# EAGLE design motherboard (EAGLE 9.6.2)
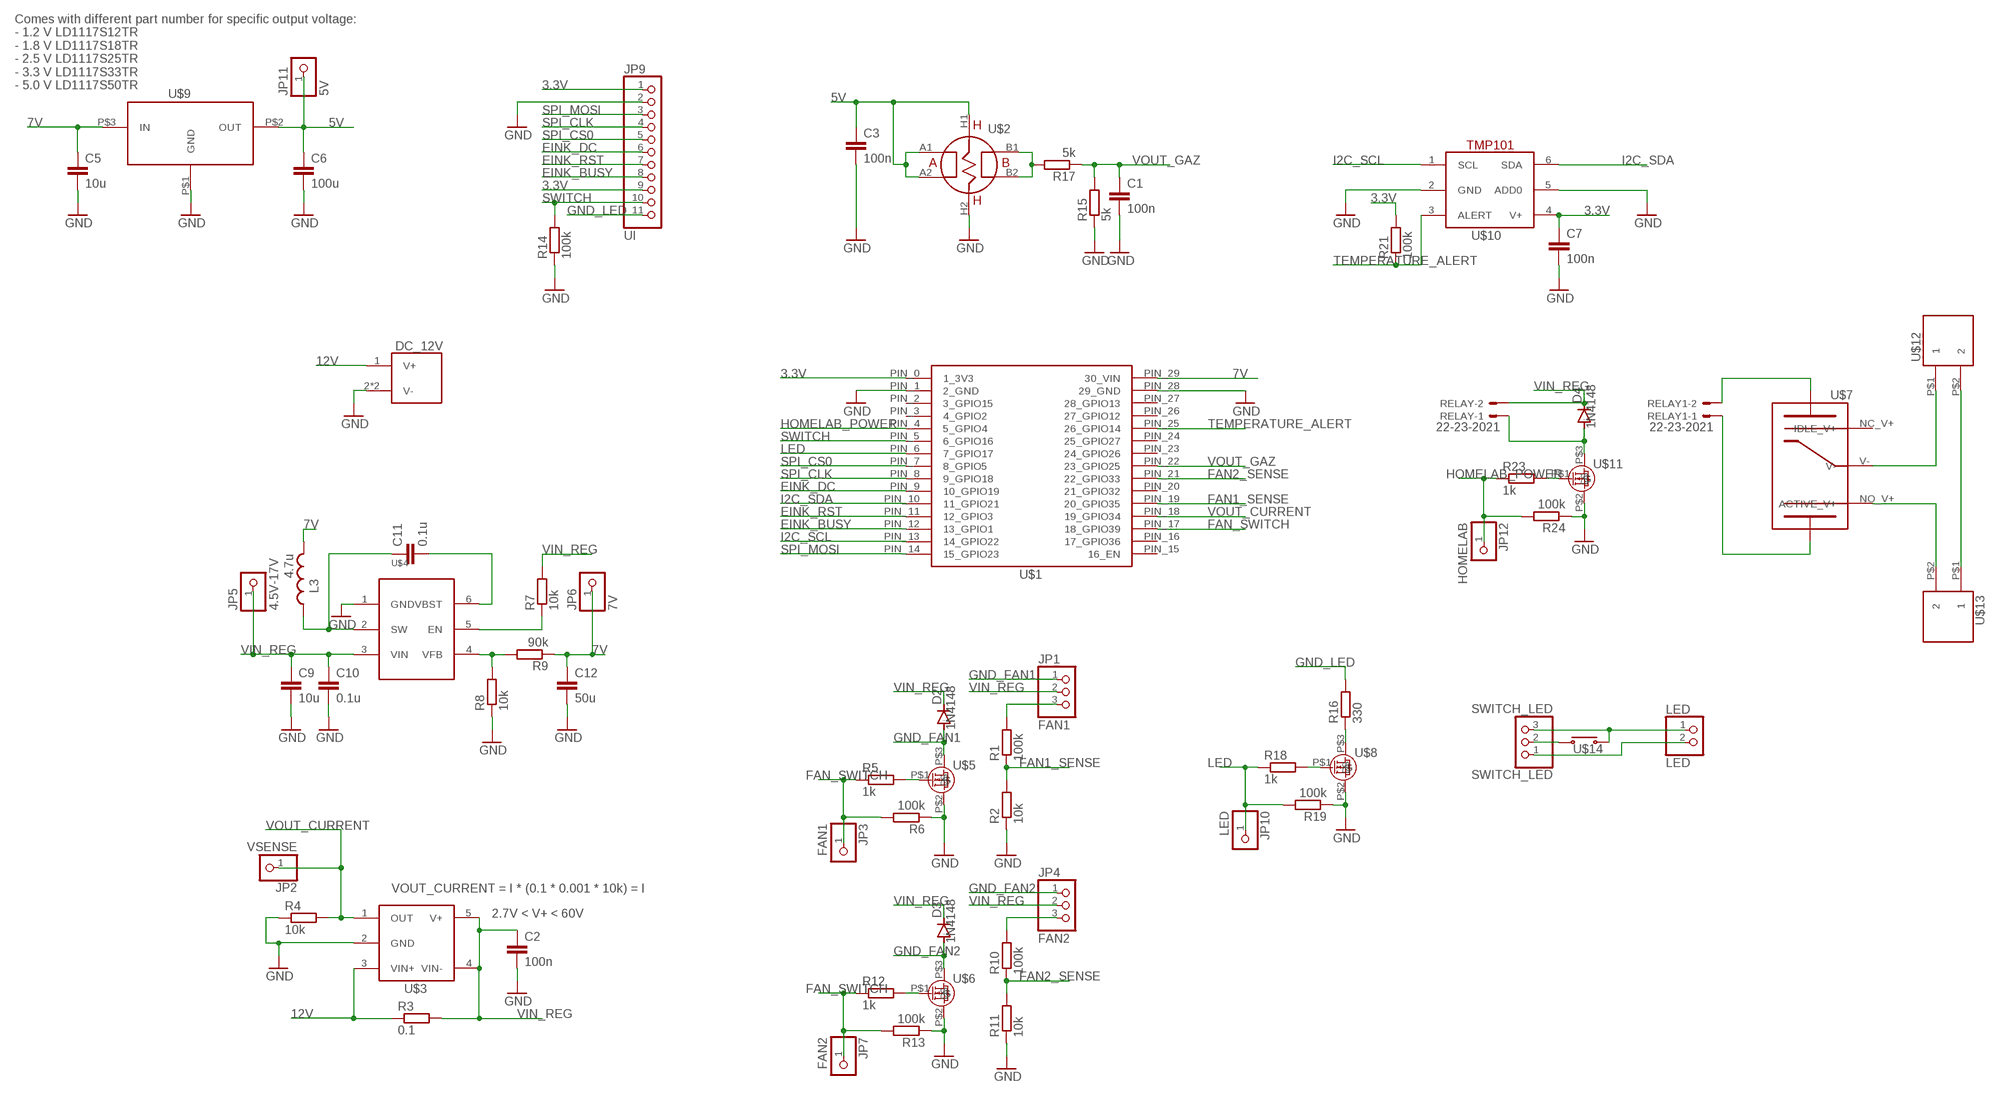
[diagram p0: schematic, sheet 1]

## Parts
C1  100n  C-EUC0805  [C0805]
C2  100n  C-EUC0805  [C0805]
C3  100n  C-EUC0805  [C0805]
C5  10u  C-EUC0805  [C0805]
C6  100u  C-EUC0805  [C0805]
C7  100n  C-EUC0805  [C0805]
C9  10u  C-EUC0805  [C0805]
C10  0.1u  C-EUC0805  [C0805]
C11  0.1u  C-EUC0805  [C0805]
C12  50u  C-EUC0805  [C0805]
D2  1N4148  DIODE-DO-214AC  [DO-214AC]
D3  1N4148  DIODE-DO-214AC  [DO-214AC]
D4  1N4148  DIODE-DO-214AC  [DO-214AC]
DC_12V  DC_POWER_2.1MM  [DC_POWER_2.1MM]
JP1  FAN1  PINHD-1X3  [1X03]
JP2  VSENSE  PINHD-1X1  [1X01]
JP3  FAN1  PINHD-1X1  [1X01]
JP4  FAN2  PINHD-1X3  [1X03]
JP5  4.5V-17V  PINHD-1X1  [1X01]
JP6  7V  PINHD-1X1  [1X01]
JP7  FAN2  PINHD-1X1  [1X01]
JP9  UI  PINHD-1X11  [1X11]
JP10  LED  PINHD-1X1  [1X01]
JP11  5V  PINHD-1X1  [1X01]
JP12  HOMELAB  PINHD-1X1  [1X01]
L3  4.7u  L-USL3225M  [L3225M]
LED  LED  PINHD-1X2  [1X02]
R1  100k  R-EU_R0805  [R0805]
R2  10k  R-EU_R0805  [R0805]
R3  0.1  R-EU_R1206  [R1206]
R4  10k  R-EU_R0805  [R0805]
R5  1k  R-EU_R0805  [R0805]
R6  100k  R-EU_R0805  [R0805]
R7  10k  R-EU_R0805  [R0805]
R8  10k  R-EU_R0805  [R0805]
R9  90k  R-EU_R0805  [R0805]
R10  100k  R-EU_R0805  [R0805]
R11  10k  R-EU_R0805  [R0805]
R12  1k  R-EU_R0805  [R0805]
R13  100k  R-EU_R0805  [R0805]
R14  100k  R-EU_R0805  [R0805]
R15  5k  R-EU_R0805  [R0805]
R16  330  R-EU_R0805  [R0805]
R17  5k  R-EU_R0805  [R0805]
R18  1k  R-EU_R0805  [R0805]
R19  100k  R-EU_R0805  [R0805]
R21  100k  R-EU_R0805  [R0805]
R23  1k  R-EU_R0805  [R0805]
R24  100k  R-EU_R0805  [R0805]
RELAY  22-23-2021  [22-23-2021]
RELAY1  22-23-2021  [22-23-2021]
SWITCH_LED  SWITCH_LED  PINHD-1X3  [1X03]
U$1  ESP32_DEVKIT_V1  [ESP32_DEVKIT_V1]
U$2  MQ_2  [MQ_2]
U$3  INA169  [SOT23_5_PIN]
U$4  TPS561201  [SOT23_6_PIN]
U$5  MGSF1N03L  [SOT23_3_PIN]
U$6  MGSF1N03L  [SOT23_3_PIN]
U$7  RELAY_SONGLE  [RELAY_SONGLE]
U$8  MGSF1N03L  [SOT23_3_PIN]
U$9  LD1117  [SOT223_3_PIN]
U$10  TMP101  [SOT23_6_PIN]
U$11  MGSF1N03L  [SOT23_3_PIN]
U$12  SCREW_TERMINAL  [SCREW_TERMINAL]
U$13  SCREW_TERMINAL  [SCREW_TERMINAL]
U$14  MOMENTARY_SWITCH  [MOMENTARY_SWITCH]

## Nets
3.3V: C7.1 JP9.1 JP9.9 R21.2 U$1.PIN_0(1_3V3) U$10.4(V+)
5V: C3.1 C6.1 JP11.1 U$2.A1 U$2.A2 U$2.H1 U$9.P$2(OUT)
7V: C5.1 C12.1 JP6.1 L3.2 R9.1 U$1.PIN_29(30_VIN) U$9.P$3(IN)
12V: DC_12V.1(V+) R3.1 U$3.3(VIN+)
EINK_BUSY: JP9.8 U$1.PIN_12(13_GPIO1)
EINK_DC: JP9.6 U$1.PIN_9(10_GPIO19)
EINK_RST: JP9.7 U$1.PIN_11(12_GPIO3)
FAN1_SENSE: R1.1 R2.2 U$1.PIN_19(20_GPIO35)
FAN2_SENSE: R10.1 R11.2 U$1.PIN_21(22_GPIO33)
FAN_SWITCH: JP3.1 JP7.1 R5.1 R6.2 R12.1 R13.2 U$1.PIN_17(18_GPIO39)
GND: C1.2 C2.2 C3.2 C5.2 C6.2 C7.2 C9.2 C10.2 C12.2 DC_12V.2(V-) DC_12V.3(V-) JP9.2 R2.1 R4.1 R6.1 R8.1 R11.1 R13.1 R14.1 R15.1 R19.1 R24.1 U$1.PIN_1(2_GND) U$1.PIN_28(29_GND) U$2.H2 U$3.2(GND) U$4.1(GND) U$5.P$2(S) U$6.P$2(S) U$8.P$2(S) U$9.P$1(GND) U$10.2(GND) U$10.5(ADD0) U$11.P$2(S)
GND_FAN1: D2.A JP1.1 U$5.P$3(D)
GND_FAN2: D3.A JP4.1 U$6.P$3(D)
GND_LED: JP9.11 R16.2
GND_RELAY: D4.A RELAY.1 U$11.P$3(D)
HOMELAB_POWER: JP12.1 R23.1 R24.2 U$1.PIN_4(5_GPIO4)
I2C_SCL: U$1.PIN_13(14_GPIO22) U$10.1(SCL)
I2C_SDA: U$1.PIN_10(11_GPIO21) U$10.6(SDA)
LED: JP10.1 R18.1 R19.2 U$1.PIN_6(7_GPIO17)
N$1: JP1.3 R1.2
N$2: R5.2 U$5.P$1(G)
N$3: JP4.3 R10.2
N$4: R12.2 U$6.P$1(G)
N$5: R17.2 U$2.B1 U$2.B2
N$6: RELAY1.2 U$7.COMMAND_V+
N$7: LED.1 SWITCH_LED.3 U$14.B1 U$14.B2
N$8: R18.2 U$8.P$1(G)
N$9: C11.2 U$4.6(VBST)
N$10: R7.1 U$4.5(EN)
N$11: R8.2 R9.2 U$4.4(VFB)
N$12: C11.1 L3.1 U$4.2(SW)
N$13: R23.2 U$11.P$1(G)
N$14: R16.1 U$8.P$3(D)
N$15: RELAY1.1 U$7.COMMAND_V-
N$16: U$12.P$2 U$13.P$1
N$17: U$7.V- U$12.P$1
N$18: U$7.NO_V+(ACTIVE_V+) U$13.P$2
N$19: LED.2 SWITCH_LED.1
N$20: SWITCH_LED.2 U$14.A1 U$14.A2
SPI_CLK: JP9.4 U$1.PIN_8(9_GPIO18)
SPI_CS0: JP9.5 U$1.PIN_7(8_GPIO5)
SPI_MOSI: JP9.3 U$1.PIN_14(15_GPIO23)
SWITCH: JP9.10 R14.2 U$1.PIN_5(6_GPIO16)
TEMPERATURE_ALERT: R21.1 U$1.PIN_25(26_GPIO14) U$10.3(ALERT)
VIN_REG: C2.1 C9.1 C10.1 D2.C D3.C D4.C JP1.2 JP4.2 JP5.1 R3.2 R7.2 RELAY.2 U$3.4(VIN-) U$3.5(V+) U$4.3(VIN)
VOUT_CURRENT: JP2.1 R4.2 U$1.PIN_18(19_GPIO34) U$3.1(OUT)
VOUT_GAZ: C1.1 R15.2 R17.1 U$1.PIN_22(23_GPIO25)
Unconnected: U$1.PIN_2(3_GPIO15) U$1.PIN_3(4_GPIO2) U$1.PIN_15(16_EN) U$1.PIN_16(17_GPIO36) U$1.PIN_20(21_GPIO32) U$1.PIN_23(24_GPIO26) U$1.PIN_24(25_GPIO27) U$1.PIN_26(27_GPIO12) U$1.PIN_27(28_GPIO13) U$7.NC_V+(IDLE_V+)

## Notes on the sheet
- Comes with different part number for specific output voltage:
  - 1.2 V LD1117S12TR
  - 1.8 V LD1117S18TR
  - 2.5 V LD1117S25TR
  - 3.3 V LD1117S33TR
  - 5.0 V LD1117S50TR
- VOUT_CURRENT = I * (0.1 * 0.001 * 10k) = I
- 2.7V < V+ < 60V

## Library data of the parts
C1-C3 C5-C7 C9-C12 = rcl:C-EU: CAPACITOR, European symbol; SPICEPREFIX: C
D2-D4 = diode:DIODE-: DIODE
DC_12V = bzd:DC_POWER_2.1MM
JP1 JP4 SWITCH_LED = pinhead:PINHD-1X3: PIN HEADER
JP2 JP3 JP5-JP7 JP10-JP12 = pinhead:PINHD-1X1: PIN HEADER
JP9 = pinhead:PINHD-1X11: PIN HEADER
L3 = rcl:L-US: INDUCTOR, American symbol; SPICEPREFIX: L
LED = pinhead:PINHD-1X2: PIN HEADER
R1-R19 R21 R23 R24 = rcl:R-EU_: RESISTOR, European symbol; SPICEPREFIX: R
RELAY RELAY1 = con-molex:22-23-2021: .100" (2.54mm) Center Header - 2 Pin; MF: MOLEX; MPN: 22-23-2021; OC_FARNELL: 1462926; OC_NEWARK: 25C3832
U$1 = bzd:ESP32_DEVKIT_V1
U$2 = bzd:MQ_2
U$3 = bzd:INA169
U$4 = bzd:TPS561201
U$5 U$6 U$8 U$11 = bzd:MGSF1N03L
U$7 = bzd:RELAY_SONGLE
U$9 = bzd:LD1117
U$10 = bzd:TMP101
U$12 U$13 = bzd:SCREW_TERMINAL
U$14 = bzd:MOMENTARY_SWITCH

## Board
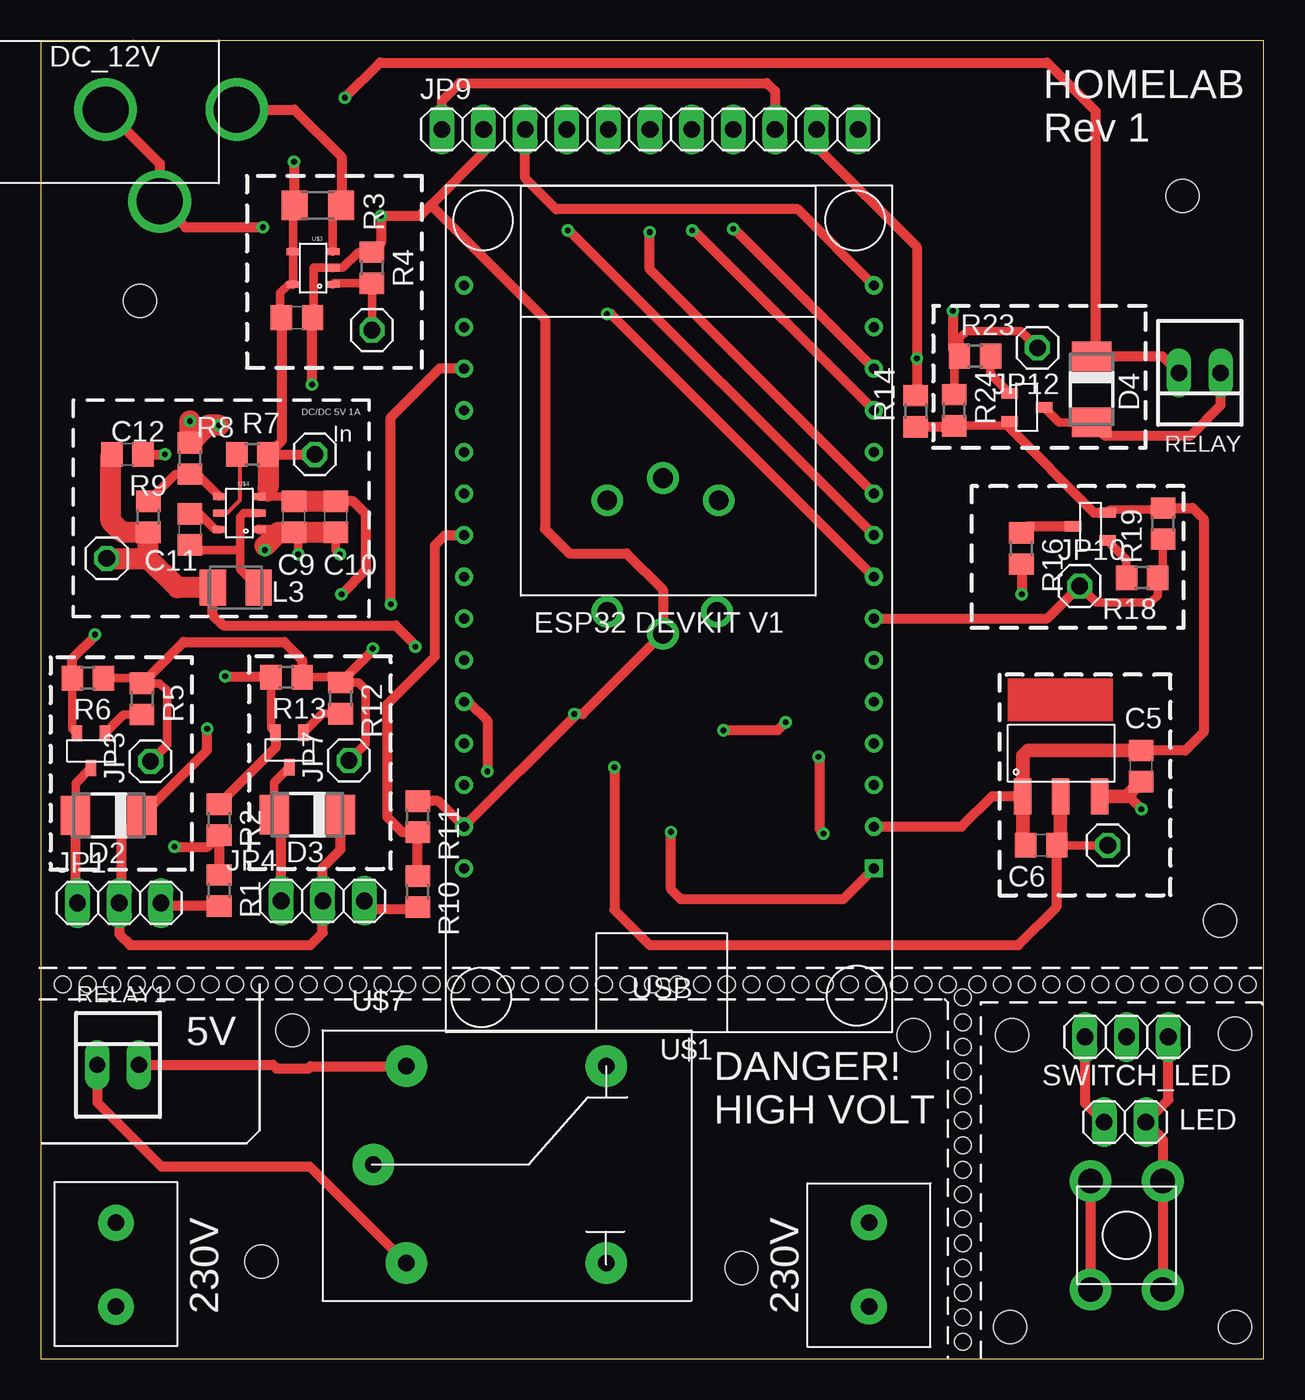
[diagram p1: board, top side]
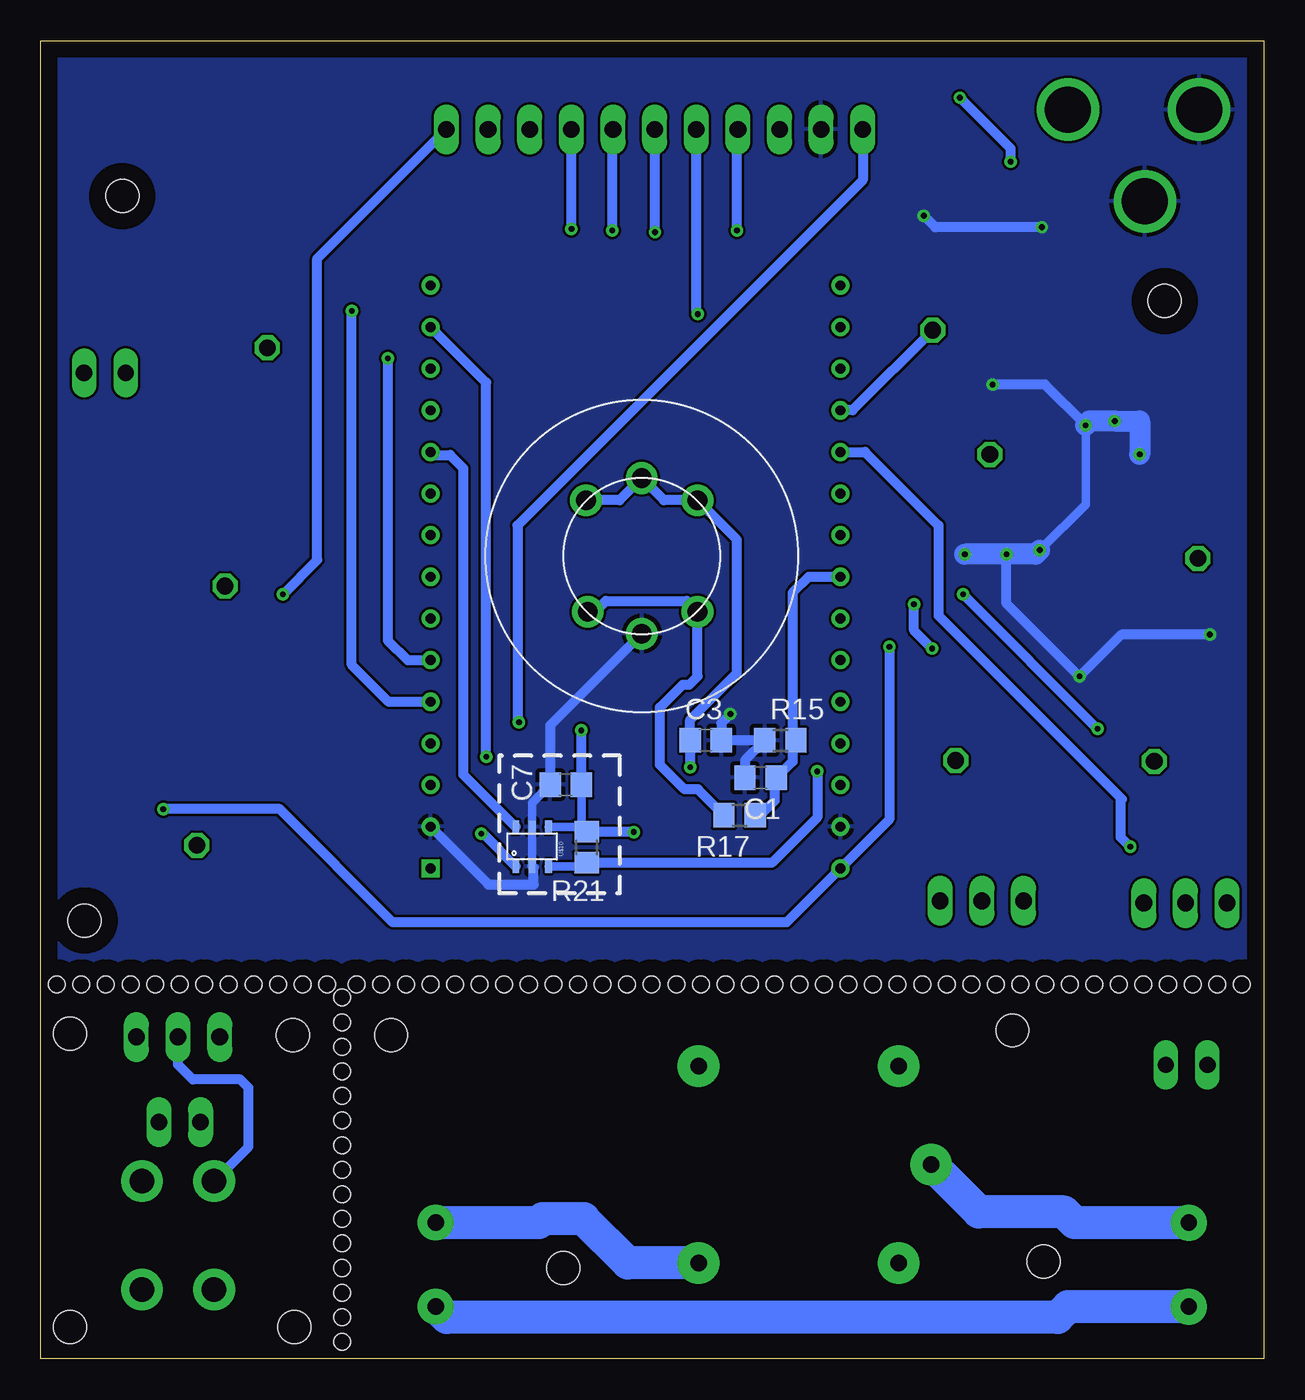
[diagram p2: board, bottom side, seen from below]

Size 74.6 x 80.38 mm. Coordinates in mm from the lower left corner, seen from the top.
Outline: 0,0 74.6,0 74.6,80.38 0,80.38 0,0
Copper layers (1*16): Top 0.035mm / dielectric 1.5mm / Bottom 0.035mm
Design rules "default": minimum track width 6mil, minimum drill 0.35mm, track to track 6mil, track to pad 6mil, pad to pad 6mil, via to via 6mil, smd to smd 6mil, copper to edge 40mil, drill to drill 6mil, minimum pad ring 10mil, minimum via ring 8mil, stop-mask expansion 4mil, vias tented up to drill 0mil, thermal gap 10mil
Holes 1 mm at 56.24,1.02 56.24,2.52 56.24,4.02 56.24,5.52 56.24,7.02 56.24,8.52 56.24,10.02 56.24,11.52 56.24,13.02 56.24,14.52 56.24,16.02 56.24,17.52 56.24,19.02 56.24,20.52 56.24,22.02 73.64,22.82 72.14,22.82 70.64,22.82 69.14,22.82 67.64,22.82 66.14,22.82 64.64,22.82 63.14,22.82 61.64,22.82 60.14,22.82 58.64,22.82 57.14,22.82 55.34,22.82 53.84,22.82 52.34,22.82 50.84,22.82 49.34,22.82 47.84,22.82 46.34,22.82 44.84,22.82 43.34,22.82 41.84,22.82 40.34,22.82 38.84,22.82 37.34,22.82 35.84,22.82 34.34,22.82 32.84,22.82 31.34,22.82 29.84,22.82 28.34,22.82 26.84,22.82 25.34,22.82 23.84,22.82 22.34,22.82 20.84,22.82 19.34,22.82 17.84,22.82 16.34,22.82 14.84,22.82 13.34,22.82 11.84,22.82 10.34,22.82 8.84,22.82 7.34,22.82 5.84,22.82 4.34,22.82 2.84,22.82 1.34,22.82
Holes 2 mm at 53.24,19.72 15.34,20.02 42.74,5.52 13.44,5.92 69.64,70.92 71.94,26.72 6.04,64.52 59.24,19.72 72.84,1.92 72.84,19.82 59.14,1.92

### Footprints (pad centres in the part's own frame; a part is rotated, then mirrored left to right if it is on the bottom)
C0805 = smd 1.3 x 1.5: 1 -0.95,0; 2 0.95,0
DO-214AC = smd 1.8 x 2.4: A 2.025,0; C -2.025,0
DC_POWER_2.1MM = drill 2.8 pad 3.81: 1 15.5,0; 2 7.5,0; 3 10.8,-5.6
1X03 = drill 1.016 long: 1 -2.54,0; 2 0,0; 3 2.54,0
1X01 = drill 1.016 octagon: 1 0,0
1X11 = drill 1.016 long: 1 -12.7,0; 2 -10.16,0; 3 -7.62,0; 4 -5.08,0; 5 -2.54,0; 6 0,0; 7 2.54,0; 8 5.08,0; 9 7.62,0; 10 10.16,0; 11 12.7,0
L3225M = smd 1.6 x 2.2: 1 -1.4,0; 2 1.4,0
1X02 = drill 1.016 long: 1 -1.27,0; 2 1.27,0
R0805 = smd 1.3 x 1.5: 1 -0.95,0; 2 0.95,0
R1206 = smd 1.6 x 1.803: 1 -1.422,0; 2 1.422,0
22-23-2021 = drill 1 long: 1 -1.27,0; 2 1.27,0
ESP32_DEVKIT_V1 = drill 0.6 square: PIN_0 -12.954,17.526 | drill 0.6: PIN_1 -12.954,14.986; PIN_2 -12.954,12.446; PIN_3 -12.954,9.906; PIN_4 -12.954,7.366; PIN_5 -12.954,4.826; PIN_6 -12.954,2.286; PIN_7 -12.954,-0.254; PIN_8 -12.954,-2.794; PIN_9 -12.954,-5.334; PIN_10 -12.954,-7.874; PIN_11 -12.954,-10.414; PIN_12 -12.954,-12.954; PIN_13 -12.954,-15.494; PIN_14 -12.954,-18.034; PIN_15 12.046,-18.034; PIN_16 12.046,-15.494; PIN_17 12.046,-12.954; PIN_18 12.046,-10.414; PIN_19 12.046,-7.874; PIN_20 12.046,-5.334; PIN_21 12.046,-2.794; PIN_22 12.046,-0.254; PIN_23 12.046,2.286; PIN_24 12.046,4.826; PIN_25 12.046,7.366; PIN_26 12.046,9.906; PIN_27 12.046,12.446; PIN_28 12.046,14.986; PIN_29 12.046,17.526
MQ_2 = drill 1.2 pad 1.93: A1 -3.4,-3.4; A2 3.4,-3.4; B1 -3.4,3.4; B2 3.3,3.4; H1 0,-4.75; H2 0,4.75
SOT23_5_PIN = smd 0.813 x 0.406: 1 -0.4,-0.5; 2 -0.4,-1.5; 3 -0.4,-2.5; 4 2,-2.5; 5 2,-0.5
SOT23_6_PIN = smd 0.813 x 0.406: 1 -0.4,-0.5; 2 -0.4,-1.5; 3 -0.4,-2.5; 4 2,-2.5; 5 2,-1.5; 6 2,-0.5
SOT23_3_PIN = smd 1 x 0.635: P$1 1.7,-2.3; P$2 1.7,-0.6; P$3 -0.4,-1.45
RELAY_SONGLE = drill 1 pad 2.54: COMMAND_V+ 0,0; COMMAND_V- 0,-12; NC_V+ 12.2,0; NO_V+ 12.2,-12; V- -2,-6
SOT223_3_PIN = smd 1.067 x 2.184: P$1 0.9,-4.4; P$2 3.2,-4.4; P$3 5.6,-4.4
SCREW_TERMINAL = drill 1 pad 2.184: P$1 -0.03,0; P$2 5.09,0
MOMENTARY_SWITCH = drill 1.5 pad 2.54: A1 0.8,0.3; A2 0.8,-6.3; B1 5.2,0.3; B2 5.2,-6.3

### Placement (x,y rotation side)
C1  30.7,35.44 180 bottom
C2  15.62,63.5 0 top
C3  34.04,37.71 0 bottom
C5  67.12,36.14 90 top
C6  61.03,31.32 180 top
C7  42.58,35.01 180 bottom
C9  15.44,51.35 270 top
C10  17.98,51.35 270 top
C11  9.09,50.59 90 top
C12  5.28,55.16 0 top
D2  4.14,33.13 180 top
D3  16.25,33.18 180 top
D4  64.1,59.12 270 top
DC_12V  -3.56,76.2 0 top
JP1  4.77,27.79 0 top
JP2  20.19,62.74 180 top
JP3  6.68,36.43 90 top
JP4  17.19,27.92 0 top
JP5  16.71,55.16 180 top
JP6  4.01,48.81 180 top
JP7  18.79,36.48 90 top
JP9  37.16,74.99 0 top
JP10  63.37,47.13 0 top
JP11  65.09,31.32 0 top
JP12  60.8,61.66 180 top
L3  11.88,47.03 180 top
LED  66.14,14.42 180 top
R1  10.87,28.56 270 top
R2  10.87,32.87 270 top
R3  16.89,70.36 180 top
R4  20.19,66.55 270 top
R5  6.17,40.24 270 top
R6  2.87,41.51 0 top
R7  12.9,55.16 0 top
R8  9.09,54.91 270 top
R9  6.55,51.35 90 top
R10  22.98,28.48 270 top
R11  22.98,33.05 270 top
R12  18.28,40.29 270 top
R13  14.98,41.56 0 top
R14  53.37,57.79 90 top
R15  29.49,37.71 0 bottom
R16  59.81,49.42 270 top
R17  31.98,33.14 180 bottom
R18  67.18,47.64 180 top
R19  68.45,50.94 270 top
R21  41.31,31.2 90 bottom
R23  56.98,61.16 0 top
R24  55.71,57.85 90 top
RELAY  70.7,60.14 180 top
RELAY1  4.7,17.92 0 top
SWITCH_LED  66.24,19.62 0 top
U$1  37.87,47.43 180 top
U$2  37.95,48.97 180 bottom
U$3  17.4,65.02 180 top
U$4  12.9,50.08 180 top
U$5  1.6,36.43 90 top
U$6  13.71,36.48 90 top
U$7  22.28,17.83 0 top
U$8  63.37,52.21 0 top
U$9  58.99,38.68 0 top
U$10  46.14,30.43 90 bottom
U$11  60.8,56.59 180 top
U$12  4.57,8.25 270 top
U$13  50.52,3.2 90 top
U$14  63.24,10.52 0 top

### Tracks (layer width: path | path; a pad name or v marks a point on that pad's centre or on a via)
3.3V  (via drill 0.35)
  Top 0.61: JP9.9 44.78,77.32 44.28,77.82 25.54,77.82 24.46,76.74 JP9.1 | U$1.PIN_0 48.93,28.02 39.04,28.02 38.44,28.62 v38.44,32.12 | v45.44,38.82 44.94,38.32 v41.64,38.32
  Bottom 0.508: 41.6,32.44 U$10.4 | 41.63,32.47 C7.1
  Bottom 0.61: v38.44,32.12 41.28,32.12 R21.2 | JP9.1 24.46,71.9 45.54,50.82 45.54,38.82 v45.44,38.82 | v41.64,38.32 C7.1 | R21.2 41.6,32.44 | R21.2 41.63,32.47
5V  (via drill 0.35)
  Top 0.508: 62.19,31.53 C6.1 JP11.1
  Top 0.61: v34.99,36.07 34.99,27.37 37.14,25.22 59.64,25.22 61.98,27.56 C6.1 | C6.1 | JP11.1
  Top 0.813: U$9.P$2 62.19,31.53
  Bottom 0.61: U$2.A2 39.3,52.37 U$2.H1 36.6,52.37 U$2.A1 32.14,49.96 32.14,41.82 34.99,38.97 C3.1 34.99,36.17 35.04,36.12 v34.99,36.07
7V  (via drill 0.35)
  Top 0.61: v67.14,33.52 66.54,34.11 66.54,34.61 | L3.2 10.48,45.37 11.14,44.72 21.64,44.72 22.84,43.52 v22.84,43.42 | C12.1 | C12.1 4.26,55.09 | R9.1
  Top 0.813: C5.1 66.54,34.61 66.21,34.28 U$9.P$3
  Top 1.27: L3.2 8.33,47.03 6.55,48.81 | JP6.1 6.55,48.81 | 6.55,48.81 R9.1 4.96,50.4 4.26,51.1 4.26,55.09
  Bottom 0.61: v67.14,33.52 60.04,33.52 53.14,26.62 29.11,26.62 U$1.PIN_29 22.84,32.89 v22.84,43.42
12V
  Top 0.508: U$3.3 17.8,69.84 R3.1
  Top 0.61: DC_12V.1 15.46,76.2 18.34,73.32 18.34,70.38 R3.1
EINK_BUSY  (via drill 0.35)
  Top 0.61: U$1.PIN_12 42.29,68.92 v42.24,68.92
  Bottom 0.61: v42.24,68.92 JP9.8
EINK_DC  (via drill 0.35)
  Top 0.61: U$1.PIN_9 37.14,66.45 v37.14,68.72
  Bottom 0.61: v37.14,68.72 37.14,74.97 JP9.6
EINK_RST  (via drill 0.35)
  Top 0.61: U$1.PIN_11 39.85,68.82 v39.74,68.82
  Bottom 0.61: v39.74,68.82 39.74,74.95 JP9.7
FAN1_SENSE  (via drill 0.35)
  Top 0.61: R1.1 R2.2 10.16,31.22 v8.14,31.22
  Bottom 0.61: U$1.PIN_19 24.33,55.31 19.84,50.82 19.84,45.32 8.64,34.12 8.74,34.12 8.74,31.82 v8.14,31.22
FAN2_SENSE
  Top 0.61: R10.1 R11.2 22.05,32.1 21.14,33.02 21.14,39.92 24.04,42.82 24.04,49.62 24.65,50.23 U$1.PIN_21
FAN_SWITCH  (via drill 0.35)
  Top 0.508: R6.2 5.85,41.51 R5.1 7.25,41.19 7.7,40.75 7.7,37.45 JP3.1 | R13.2 17.96,41.56 R12.1 19.36,41.24 19.81,40.8 19.81,37.5 JP7.1
  Top 0.61: R5.1 8.7,43.72 14.84,43.72 15.93,42.63 R13.2 | R12.1 20.34,43.3 20.34,43.32 v20.24,43.32 | v21.34,46.02 21.34,57.42 24.34,60.42 25.79,60.42 U$1.PIN_17
  Bottom 0.61: v20.24,43.32 21.34,44.42 v21.34,46.02
GND  (via drill 0.35)
  Top 0.508: 14.94,50.58 15.26,50.58 C9.2 15.69,50.15 v15.69,49.06 | v18.23,49.06 17.98,49.32 C10.2 | C2.2 16.64,63.57 16.64,66.55 17.77,66.55 U$3.2 17.82,66.55 18.41,66.55 19.36,67.5 R4.1 | U$5.P$2 1.92,38.41 R6.1 | U$6.P$2 14.03,38.46 R13.1 | U$8.P$2 65.25,51.79 68.35,51.79 R19.1 | 59.89,31.5 C6.2 | U$11.P$2 58.88,56.97 58.81,56.91 56.14,56.91 R24.1
  Top 0.61: DC_12V.2 7.24,72.9 DC_12V.3 8.82,69.02 v13.54,69.02 | R4.1 20.74,68.04 v20.74,69.72 23.14,69.72 23.79,70.37 | JP9.2 27,73.58 23.79,70.37 | 58.88,56.97 64.25,51.61 U$8.P$2 | R19.1 70.27,51.89 70.94,51.22 70.94,38.22 69.81,37.09 C5.2 | U$1.PIN_1 56.17,32.45 58.04,34.32 59.86,34.32 U$9.P$1 | R11.1 24.27,34.01 U$1.PIN_28 32.64,39.26 32.64,39.32 | 32.64,39.32 v32.54,39.32 | 32.64,39.32 33.05,39.32 U$2.H2 37.95,46.91 35.74,49.12 32.24,49.12 30.74,50.62 30.74,63.42 23.79,70.37 | R14.1 56.07,56.84 56.14,56.91 | v16.54,59.42 16.54,63.47 C2.2 | U$6.P$2 14.31,37.27 R2.1 | R6.1 1.92,42.7 3.34,44.12 v3.29,44.17 | v11.24,41.62 13.98,41.62 R13.1 | U$4.1 14.94,50.58 | U$9.P$1 | v13.66,49.32 13.66,49.57 | C12.2 v7.57,55.16 | R8.1 | v10.87,56.94
  Top 0.813: 59.89,31.5 U$9.P$1 59.89,36.79 60.2,37.09 C5.2
  Top 1.27: C10.2 C9.2 14.49,50.4 13.66,49.57 | v10.87,56.94 10.17,56.94 R8.1 v9.09,57.19
  Bottom 0.508: v13.66,49.32 10.87,52.11 v10.87,56.94 | C7.2 44.64,33.9 U$10.5 U$10.2
  Bottom 0.61: U$10.2 44.54,29.93 44.54,28.92 47.29,28.92 U$1.PIN_1 | v13.54,69.02 20.04,69.02 v20.74,69.72 | C1.2 31.65,36.51 R15.1 C3.2 33.09,38.77 v32.54,39.32 | U$2.H2 43.53,38.63 C7.2 | v10.87,56.94 13.35,59.42 v16.54,59.42 | v3.29,44.17 8.69,44.17 v11.24,41.62 15.69,46.08 v15.69,49.06 | v10.87,56.94 | v13.66,49.32
  Bottom 1.27: v13.66,49.32 13.92,49.06 v15.69,49.06 v18.23,49.06 | v7.57,55.16 7.57,57.19 v9.09,57.19 10.61,57.19 v10.87,56.94
  pour Bottom: 0.34,80.12 0.34,24.02 74.54,24.02 74.54,80.12 74.44,80.22 0.44,80.22
GND_FAN1
  Top 0.508: U$5.P$3 2.11,35.09 D2.A
  Top 0.61: JP1.1 2.11,27.91 D2.A
GND_FAN2
  Top 0.508: U$6.P$3 14.23,35.15 D3.A
  Top 0.61: JP4.1 14.65,32.75 D3.A
GND_LED  (via drill 0.35)
  Top 0.61: R16.2 59.84,48.44 v59.84,46.62
  Bottom 0.61: v59.84,46.62 57.74,48.72 57.74,67.11 JP9.11
GND_RELAY
  Top 0.508: U$11.P$3 62.13,57.1 D4.A
  Top 0.61: D4.A 64.88,56.32 70.14,56.32 71.97,58.15 RELAY.1
HOMELAB_POWER  (via drill 0.35)
  Top 0.508: R24.2 55.71,60.84 R23.1 56.03,62.24 56.48,62.68 59.78,62.68 JP12.1
  Top 0.61: v55.64,63.92 55.64,61.55 R23.1
  Bottom 0.61: U$1.PIN_4 53.39,40.07 55.64,42.32 v55.64,63.92
I2C_SCL  (via drill 0.35)
  Top 0.61: v47.74,32.02 47.54,32.22 47.54,36.62 v47.44,36.72
  Bottom 0.61: U$10.1 47.52,31.92 47.64,31.92 v47.74,32.02 | v47.44,36.72 47.44,59.54 U$1.PIN_13
I2C_SDA
  Bottom 0.61: U$1.PIN_10 50.63,55.12 49.64,55.12 48.84,54.32 48.84,35.62 45.65,32.44 U$10.6
LED
  Top 0.508: R19.2 68.45,47.96 R18.1 68.13,46.56 67.69,46.11 64.38,46.11 JP10.1
  Top 0.61: U$1.PIN_6 61.39,45.15 JP10.1
N$1
  Top 0.61: R1.2 7.5,27.61 JP1.3
N$2
  Top 0.508: U$5.P$1 5.06,39.29 R5.2
N$3
  Top 0.61: JP4.3 20.24,27.42 22.87,27.42 R10.2
N$4
  Top 0.508: U$6.P$1 17.17,39.34 R12.2
N$5
  Bottom 0.61: R17.2 34.51,34.72 35.34,34.72 36.84,36.22 36.84,39.72 35.44,41.12 35.04,41.12 34.55,41.61 U$2.B1 35.2,46.22 40.14,46.22 40.79,45.57 U$2.B2
N$6
  Top 0.61: RELAY1.2 14.16,17.92 14.38,17.7 16.3,17.7 16.43,17.83 U$7.COMMAND_V+
N$7
  Top 0.61: SWITCH_LED.3 68.78,15.79 LED.1 68.44,13.39 U$14.B1 U$14.B2
N$8
  Top 0.508: U$8.P$1 66.23,48.75 R18.2
N$9
  Top 0.508: U$4.6 10.62,50.58 9.66,51.54 C11.2
N$10
  Top 0.254: U$4.5 10.92,51.6 11.38,51.6 12.14,52.37 12.14,54.97 R7.1
N$11
  Top 0.508: U$4.4 9.52,53.96 R8.2 8.21,53.96 R9.2
N$12
  Top 0.508: U$4.2 12.37,51.58 12.14,51.35 12.14,49.32 | 12.14,49.32 12.14,48.18 L3.1 | C11.1 9.41,49.32 12.14,49.32
N$13
  Top 0.508: U$11.P$1 57.94,60.05 R23.2
N$14
  Top 0.61: U$8.P$3 60.21,50.76 R16.1
N$15
  Top 0.61: RELAY1.1 3.43,15.62 3.44,15.62 7.34,11.72 16.4,11.72 U$7.COMMAND_V-
N$16
  Bottom 2: U$12.P$2 11.93,3.17 12.59,2.5 49.85,2.5 U$13.P$1
N$17
  Bottom 2: U$12.P$1 11.54,8.29 12.19,8.94 17.38,8.94 U$7.V-
N$18
  Bottom 2: U$7.NO_V+ 38.79,5.83 41.49,8.54 43.99,8.54 44.23,8.29 U$13.P$2
N$19
  Top 0.61: SWITCH_LED.1 63.7,15.59 LED.2
N$20
  Top 0.61: U$14.A2 U$14.A1
  Bottom 0.61: U$14.A1 61.94,12.92 61.94,16.52 62.44,17.02 65.34,17.02 66.24,17.92 SWITCH_LED.2
SPI_CLK  (via drill 0.35)
  Top 0.61: U$1.PIN_8 32.23,68.82 v32.14,68.82
  Bottom 0.61: v32.14,68.82 32.14,74.93 JP9.4
SPI_CS0  (via drill 0.35)
  Top 0.61: U$1.PIN_7 34.79,63.72 v34.54,63.72
  Bottom 0.61: v34.54,63.72 34.62,63.8 JP9.5
SPI_MOSI
  Top 0.61: U$1.PIN_14 46.17,70.12 31.44,70.12 29.54,72.02 JP9.3
SWITCH  (via drill 0.35)
  Top 0.61: JP9.10 47.32,73.94 53.44,67.82 v53.44,61.02 53.44,58.81 R14.2
  Bottom 0.61: v53.44,61.02 53.44,43.82 52.23,42.61 U$1.PIN_5
TEMPERATURE_ALERT  (via drill 0.35)
  Top 0.61: U$1.PIN_25 26.09,40.07 27.24,38.92 v27.24,35.82
  Bottom 0.508: U$10.3 41.52,30.04 R21.1
  Bottom 0.61: R21.1 30.01,30.25 27.24,33.02 v27.24,35.82
VIN_REG  (via drill 0.35)
  Top 0.508: C2.1 14.61,63.57 14.61,65.02 15.11,65.52 U$3.5 U$3.4 15.4,70.29 R3.2 | C9.1 15.16,52.58 13.84,52.58 U$4.3
  Top 0.61: C2.1 14.67,55.98 R7.2 JP5.1 | D4.C 64.34,61.15 | 64.34,61.15 68.42,61.15 RELAY.2 | D3.C 18.28,31.06 17.19,29.98 JP4.2 17.19,25.98 16.44,25.22 5.44,25.22 4.77,25.88 JP1.2 4.94,27.96 4.94,31.9 D2.C 10.14,37.1 v10.14,38.42 | R3.2 15.47,72.89 15.44,72.92 v15.44,73.02 | v18.54,76.92 20.68,79.06 61.4,79.06 64.34,76.12 64.34,61.15 | v18.34,46.62 19.84,48.12 19.84,51.52 19.06,52.3 C10.1 | 13.85,53.13 13.85,52.59 13.84,52.58 | U$3.4
  Top 1.27: C9.1 C10.1 | R7.2 13.85,53.13
  Bottom 0.61: v15.44,73.02 15.44,73.82 v18.54,76.92 | v10.14,38.42 v18.34,46.62
VOUT_CURRENT
  Top 0.508: JP2.1 R4.2 17.87,65.6 U$3.1
  Bottom 0.61: JP2.1 25.08,57.85 U$1.PIN_18
VOUT_GAZ
  Bottom 0.61: R15.2 28.74,37.51 | 28.74,37.51 28.74,36.42 29.72,35.44 C1.1 29.84,35.34 29.84,34.02 30.72,33.14 R17.1 | U$1.PIN_22 27.77,47.69 28.74,46.72 28.74,37.51

### Text on the board
tPlace: HOMELAB / Rev 1 | DC/DC 5V 1A | In | 5V | DANGER! / HIGH VOLT | 230V | 230V